# Altium schematic sheet LCD.SchDoc
size A4; Revision: C.2(PCB.SCH)
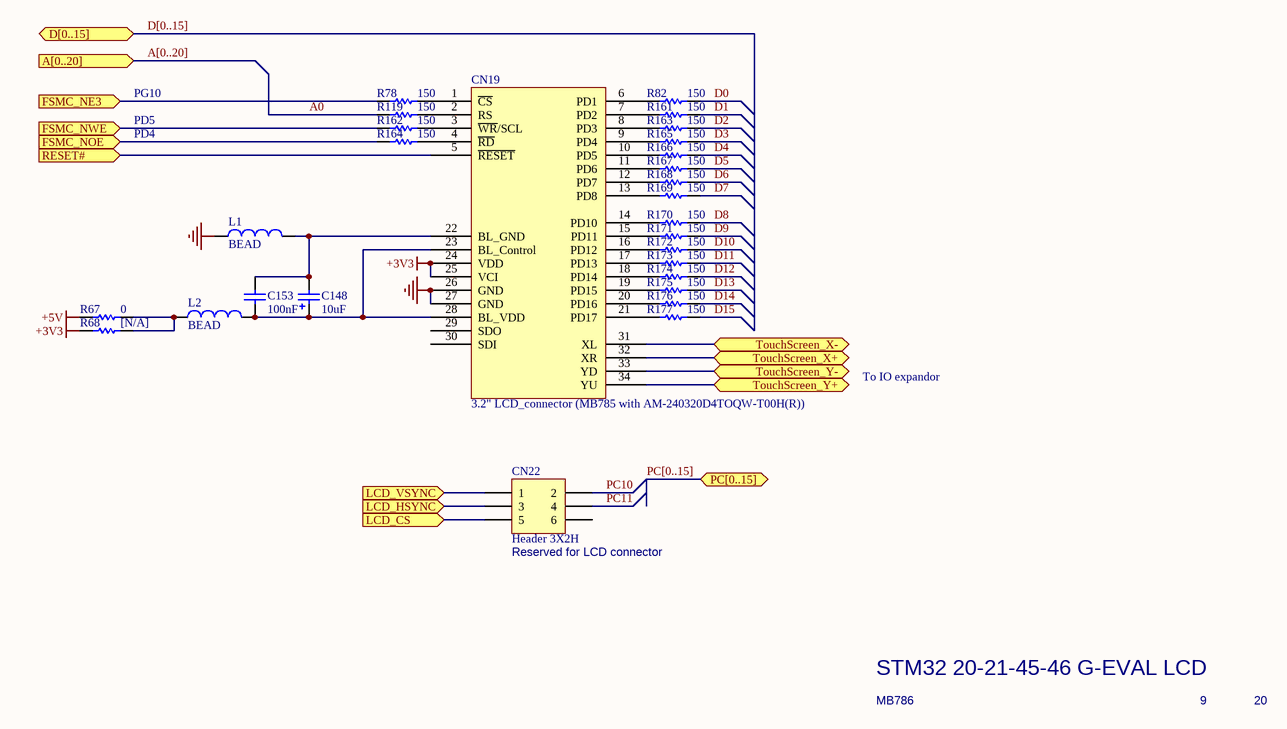
[diagram p0: LCD.SchDoc]

## Parts
C148  10uF  [TAN-A]
C153  100nF  [0402C]
CN19  3.2" LCD_connector (MB785 with AM-240320D4TOQW-T00H(R))  [AM240*320AA]
CN22  Header 3X2H  [HDR2X3H]
L1  BEAD  [0603L]
L2  BEAD  [0603L]
R67  0  [0603R]
R68  [N/A]  [0603R]
R78  150  [0603R]
R82  150  [0603R]
R119  150  [0603R]
R161  150  [0603R]
R162  150  [0603R]
R163  150  [0603R]
R164  150  [0603R]
R165  150  [0603R]
R166  150  [0603R]
R167  150  [0603R]
R168  150  [0603R]
R169  150  [0603R]
R170  150  [0603R]
R171  150  [0603R]
R172  150  [0603R]
R173  150  [0603R]
R174  150  [0603R]
R175  150  [0603R]
R176  150  [0603R]
R177  150  [0603R]

## Ports
A[0..20] (in), D[0..15] (bidir), FSMC_NE3 (in), FSMC_NOE (in), FSMC_NWE (in), LCD_CS (in), LCD_HSYNC (in), LCD_VSYNC (in), PC[0..15] (bidir), RESET# (in), TouchScreen_X+ (bidir), TouchScreen_X- (bidir), TouchScreen_Y+ (bidir), TouchScreen_Y- (bidir)

## Nets
+3V3: CN19.24(VDD) CN19.25(VCI) R68.1
+5V: R67.1
GND: CN19.26(GND) CN19.27(GND) L1.1
A0: R119.1
D0: R82.2
D1: R161.2
D2: R163.2
D3: R165.2
D4: R166.2
D5: R167.2
D6: R168.2
D7: R169.2
D8: R170.2
D9: R171.2
D10: R172.2
D11: R173.2
D12: R174.2
D13: R175.2
D14: R176.2
D15: R177.2
FSMC_NE3: R78.1 ; port FSMC_NE3
FSMC_NOE: R164.1 ; port FSMC_NOE
FSMC_NWE: R162.1 ; port FSMC_NWE
LCD_CS: CN22.5 ; port LCD_CS
LCD_HSYNC: CN22.3 ; port LCD_HSYNC
LCD_VSYNC: CN22.1 ; port LCD_VSYNC
PC10: CN22.2
PC11: CN22.4
RESET#: CN19.5(~{RESET}) ; port RESET#
TouchScreen_X+: CN19.32(XR) ; port TouchScreen_X+
TouchScreen_X-: CN19.31(XL) ; port TouchScreen_X-
TouchScreen_Y+: CN19.34(YU) ; port TouchScreen_Y+
TouchScreen_Y-: CN19.33(YD) ; port TouchScreen_Y-
NetC148_1: C148.1 C153.2 CN19.23(BL_Control) CN19.28(BL_VDD) L2.2
NetC148_2: C148.2 C153.1 CN19.22(BL_GND) L1.2
NetCN19_1: CN19.1(~{CS}) R78.2
NetCN19_2: CN19.2(RS) R119.2
NetCN19_3: CN19.3(~{WR}/SCL) R162.2
NetCN19_4: CN19.4(~{RD}) R164.2
NetCN19_6: CN19.6(PD1) R82.1
NetCN19_7: CN19.7(PD2) R161.1
NetCN19_8: CN19.8(PD3) R163.1
NetCN19_9: CN19.9(PD4) R165.1
NetCN19_10: CN19.10(PD5) R166.1
NetCN19_11: CN19.11(PD6) R167.1
NetCN19_12: CN19.12(PD7) R168.1
NetCN19_13: CN19.13(PD8) R169.1
NetCN19_14: CN19.14(PD10) R170.1
NetCN19_15: CN19.15(PD11) R171.1
NetCN19_16: CN19.16(PD12) R172.1
NetCN19_17: CN19.17(PD13) R173.1
NetCN19_18: CN19.18(PD14) R174.1
NetCN19_19: CN19.19(PD15) R175.1
NetCN19_20: CN19.20(PD16) R176.1
NetCN19_21: CN19.21(PD17) R177.1
NetL2_1: L2.1 R67.2 R68.2

Not connected (* = marked no-connect by the designer): CN19 29(SDO) 30(SDI); CN22 6

## Buses and harness runs
bus A[0..20] = port A[0..20]
bus D[0..15] = port D[0..15]
bus PC[0..15] = port PC[0..15]

## Notes on the sheet
- PD5
- PD4
- PG10
- To IO expandor
- (near CN22) Reserved for LCD connector
- STM32 20-21-45-46 G-EVAL LCD
- MB786
- 9
- 20
- STMicroelectronics
- Title:
- Number:
- Rev:
- Date:
- Sheet       of

## Library data of the parts
C148 = Cap Pol1: Polarized Capacitor (Radial); Published: 8-Jun-2000; Revision: July-2002: Re-released for DXP Platform.; Publisher: Altium Limited; Value: 10uF
C153 = Cap: Capacitor; Value: 10nF; Published: 8-Jun-2000; Revision: July-2002: Re-released for DXP Platform.; Publisher: Altium Limited
CN19 = 3.2LCD_connector
CN22 = Header 3X2H: Header, 3-Pin, Dual row, Right Angle; Revision: 17-Jul-2002: Re-released for DXP Platform.; Publisher: Altium Limited
L1 L2 = Inductor: Value: 100uH; Published: 8-Jun-2000; Revision: July-2002: Re-released for DXP Platform.; Publisher: Altium Limited
R67 R68 R78 R82 R119 R161-R177 = Res1: Resistor; Value: 1K; Published: 8-Jun-2000; Revision: July-2002: Re-released for DXP Platform.; Publisher: Altium Limited